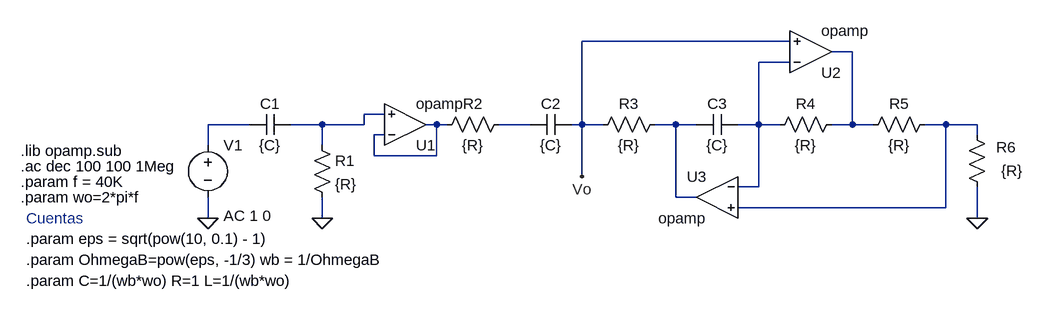
[diagram p0: schematic TS4_4.asc]
TS4_4.asc, the LTspice schematic file:
Version 4
SHEET 1 1228 680
WIRE 864 -16 544 -16
WIRE 960 0 928 0
WIRE 864 16 816 16
WIRE 240 96 208 96
WIRE 32 112 -32 112
WIRE 144 112 96 112
WIRE 208 112 208 96
WIRE 208 112 144 112
WIRE 320 112 304 112
WIRE 336 112 320 112
WIRE 464 112 416 112
WIRE 544 112 544 -16
WIRE 544 112 528 112
WIRE 576 112 544 112
WIRE 688 112 656 112
WIRE 720 112 688 112
WIRE 816 112 816 16
WIRE 816 112 784 112
WIRE 848 112 816 112
WIRE 960 112 960 0
WIRE 960 112 928 112
WIRE 992 112 960 112
WIRE 1104 112 1072 112
WIRE 1152 112 1104 112
WIRE 240 128 224 128
WIRE 1152 128 1152 112
WIRE -32 144 -32 112
WIRE 144 144 144 112
WIRE 224 160 224 128
WIRE 320 160 320 112
WIRE 320 160 224 160
WIRE 544 192 544 112
WIRE 816 208 816 112
WIRE 816 208 784 208
WIRE 688 224 688 112
WIRE 720 224 688 224
WIRE 1104 240 1104 112
WIRE 1104 240 784 240
WIRE -32 256 -32 224
WIRE 144 256 144 224
WIRE 1152 256 1152 208
FLAG -32 256 0
FLAG 144 256 0
FLAG 1152 256 0
FLAG 544 192 Vo
SYMBOL cap 96 96 R90
WINDOW 0 0 32 VBottom 2
WINDOW 3 32 32 VTop 2
SYMATTR InstName C1
SYMATTR Value {C}
SYMBOL res 128 128 R0
SYMATTR InstName R1
SYMATTR Value {R}
SYMBOL OpAmps\\opamp 272 176 M180
SYMATTR InstName U1
SYMBOL res 432 96 R90
WINDOW 0 0 56 VBottom 2
WINDOW 3 32 56 VTop 2
SYMATTR InstName R2
SYMATTR Value {R}
SYMBOL cap 528 96 R90
WINDOW 0 0 32 VBottom 2
WINDOW 3 32 32 VTop 2
SYMATTR InstName C2
SYMATTR Value {C}
SYMBOL voltage -32 128 R0
WINDOW 123 24 124 Left 2
WINDOW 39 0 0 Left 0
SYMATTR InstName V1
SYMATTR Value ""
SYMATTR Value2 AC 1 0
SYMBOL OpAmps\\opamp 896 64 M180
SYMATTR InstName U2
SYMBOL OpAmps\\opamp 752 160 M0
SYMATTR InstName U3
SYMBOL res 672 96 R90
WINDOW 0 0 56 VBottom 2
WINDOW 3 32 56 VTop 2
SYMATTR InstName R3
SYMATTR Value {R}
SYMBOL res 944 96 R90
WINDOW 0 0 56 VBottom 2
WINDOW 3 32 56 VTop 2
SYMATTR InstName R4
SYMATTR Value {R}
SYMBOL res 1088 96 R90
WINDOW 0 0 56 VBottom 2
WINDOW 3 32 56 VTop 2
SYMATTR InstName R5
SYMATTR Value {R}
SYMBOL res 1168 224 R180
WINDOW 0 -44 77 Left 2
WINDOW 3 -55 41 Left 2
SYMATTR InstName R6
SYMATTR Value {R}
SYMBOL cap 784 96 R90
WINDOW 0 0 32 VBottom 2
WINDOW 3 32 32 VTop 2
SYMATTR InstName C3
SYMATTR Value {C}
TEXT -320 224 Left 2 !.param wo=2*pi*f
TEXT -320 152 Left 2 !.lib opamp.sub
TEXT -320 200 Left 2 !.param f = 40K
TEXT -312 352 Left 2 !.param C=1/(wb*wo) R=1 L=1/(wb*wo)
TEXT -320 176 Left 2 !.ac dec 100 100 1Meg
TEXT -312 288 Left 2 !.param eps = sqrt(pow(10, 0.1) - 1)
TEXT -312 320 Left 2 !.param OhmegaB=pow(eps, -1/3) wb = 1/OhmegaB
TEXT -312 256 Left 2 ;Cuentas

The netlist it stands for:
* TS4_4.asc
C1 N003 N004 {C}
R1 N003 0 {R}
XU1 N005 N003 N005 opamp Aol=100K GBW=10Meg  ; pins invin noninvin out
R2 N006 N005 {R}
C2 Vo N006 {C}
V1 N004 0 AC 1 0
XU2 N002 Vo N001 opamp Aol=100K GBW=10Meg  ; pins invin noninvin out
XU3 N002 N008 N007 opamp Aol=100K GBW=10Meg  ; pins invin noninvin out
R3 N007 Vo {R}
R4 N001 N002 {R}
R5 N008 N001 {R}
R6 0 N008 {R}
C3 N002 N007 {C}
.param wo=2*pi*f
.lib opamp.sub
.param f = 40K
.param C=1/(wb*wo) R=1 L=1/(wb*wo)
.ac dec 100 100 1Meg
.param eps = sqrt(pow(10, 0.1) - 1)
.param OhmegaB=pow(eps, -1/3) wb = 1/OhmegaB
* Cuentas
.backanno
.end

* Results of the author's LTspice run, read from the files saved beside the schematic
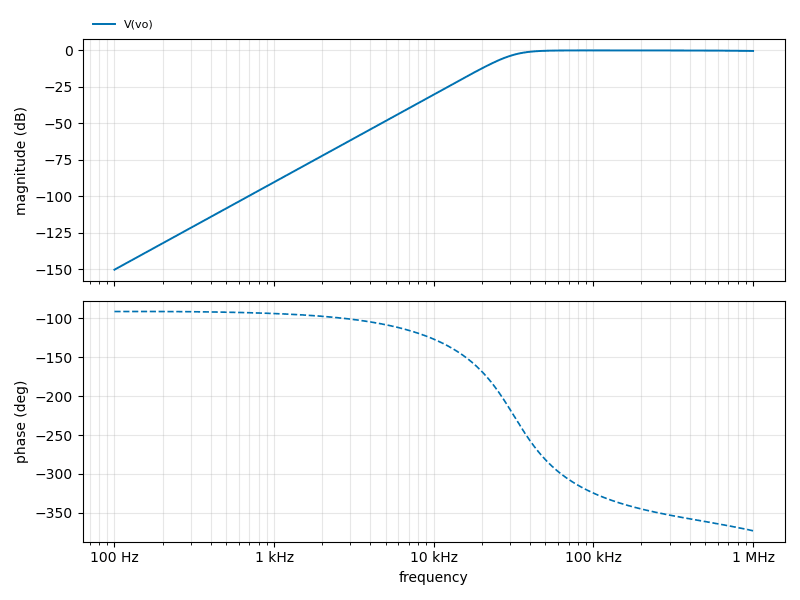
[diagram p1: AC Analysis of TS4_4.asc, plotted from the saved traces]
* AC Analysis, 1 run:
*   V(vo): -150.20 dB at 100 Hz, -0.38 dB at 1 MHz, peak -0.00 dB at 102.3 kHz, 3 dB below the peak at 31.66 kHz